# Altium schematic sheet Power_supply_Bat_sense.SchDoc
size A
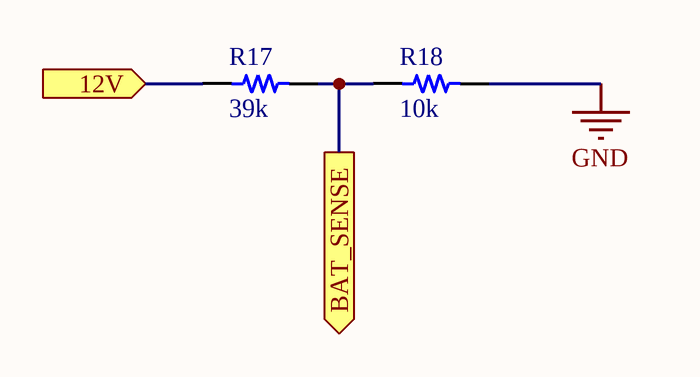
[diagram p0: Power_supply_Bat_sense.SchDoc]

## Parts
R17  value 39k  [RES 0805/2012]  (hidden comment: Resistor 39k 0805 1/10W 10%)
R18  value 10k  [RES 0805/2012]  (hidden comment: Resistor 10k 0805 1/4W 10%)

## Ports
12V (in), BAT_SENSE (out)

## Nets
GND: R18.2
12V: R17.1 ; port 12V
BAT_SENSE: R17.2 R18.1 ; port BAT_SENSE

## Library data of the parts
R17 = 2432: Manufacturer_id: 1; idResistor: 2432; Name: Res_39k_0805_1/10W_10%; Created_By: Nick Mah; Supplier 1: Digi-Key; Drawer_id: 1; Tolerance: 10%; Power: 1/10W; Package: 0805; ComponentLink1Description: Datasheet; Created_Date: 2018-10-20
R18 = 2533: Manufacturer_id: 1; idResistor: 2533; Name: Res_10k_0805_1/4W_10%; Created_By: Nick Mah; Supplier 1: Digi-Key; Drawer_id: 1; Tolerance: 10%; Power: 1/4W; Package: 0805; ComponentLink1Description: Datasheet; Created_Date: 2018-10-20